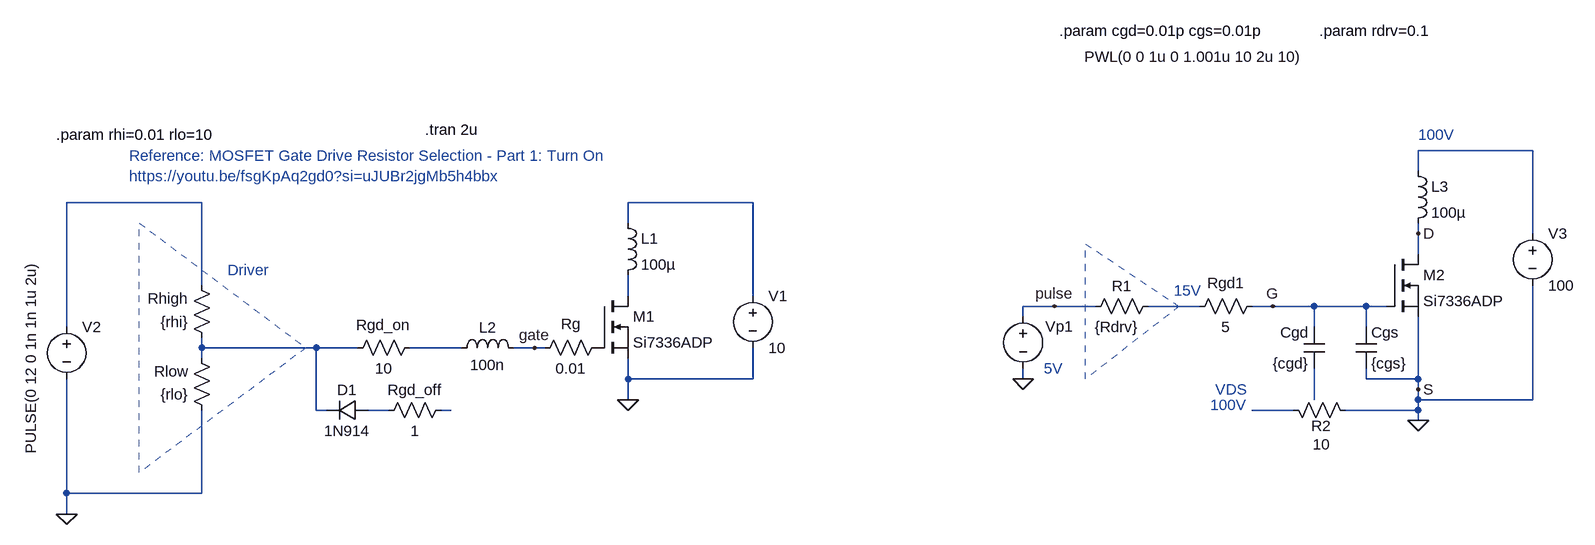
[diagram p0: schematic 04-gate_driver_model.asc]
04-gate_driver_model.asc, the LTspice schematic file:
Version 4
SHEET 1 2392 680
WIRE 2224 96 2048 96
WIRE 2048 128 2048 96
WIRE 176 176 -32 176
WIRE 1024 176 832 176
WIRE 832 208 832 176
WIRE 2048 224 2048 208
WIRE 2224 224 2224 96
WIRE 2048 256 2048 224
WIRE 176 304 176 176
WIRE 832 320 832 288
WIRE 1024 320 1024 176
WIRE 1488 336 1440 336
WIRE 1552 336 1488 336
WIRE 1712 336 1632 336
WIRE 1824 336 1792 336
WIRE 1888 336 1824 336
WIRE 1968 336 1888 336
WIRE 2000 336 1968 336
WIRE 1440 352 1440 336
WIRE -32 368 -32 176
WIRE 1888 368 1888 336
WIRE 1968 368 1968 336
WIRE 176 400 176 384
WIRE 352 400 176 400
WIRE 416 400 352 400
WIRE 576 400 496 400
WIRE 688 400 656 400
WIRE 704 400 688 400
WIRE 176 416 176 400
WIRE 832 448 832 416
WIRE 1024 448 1024 400
WIRE 1024 448 832 448
WIRE 1440 448 1440 432
WIRE 1968 448 1968 432
WIRE 2048 448 2048 352
WIRE 2048 448 1968 448
WIRE 2048 464 2048 448
WIRE 832 480 832 448
WIRE 1888 480 1888 432
WIRE 2048 480 2048 464
WIRE 2224 480 2224 304
WIRE 2224 480 2048 480
WIRE 352 496 352 400
WIRE 368 496 352 496
WIRE 464 496 432 496
WIRE 560 496 544 496
WIRE 1856 496 1792 496
WIRE 2048 496 2048 480
WIRE 2048 496 1936 496
WIRE 2048 512 2048 496
WIRE -32 624 -32 448
WIRE 176 624 176 496
WIRE 176 624 -32 624
WIRE -32 656 -32 624
FLAG 832 480 0
FLAG -32 656 0
FLAG 2048 512 0
FLAG 1440 448 0
FLAG 1824 336 G
FLAG 2048 224 D
FLAG 1488 336 pulse
FLAG 2048 464 S
FLAG 688 400 gate
SYMBOL nmos 784 320 R0
SYMATTR InstName M1
SYMATTR Value Si7336ADP
SYMBOL res 800 384 R90
WINDOW 0 -5 56 VBottom 2
WINDOW 3 32 56 VTop 2
SYMATTR InstName Rg
SYMATTR Value 0.01
SYMBOL res 512 384 R90
WINDOW 0 -4 56 VBottom 2
WINDOW 3 32 56 VTop 2
SYMATTR InstName Rgd_on
SYMATTR Value 10
SYMBOL res 192 400 R180
WINDOW 0 36 76 Left 2
WINDOW 3 36 40 Left 2
SYMATTR InstName Rhigh
SYMATTR Value {rhi}
SYMBOL res 192 512 R180
WINDOW 0 36 76 Left 2
WINDOW 3 36 40 Left 2
SYMATTR InstName Rlow
SYMATTR Value {rlo}
SYMBOL voltage 1024 304 R0
WINDOW 123 0 0 Left 0
WINDOW 39 0 0 Left 0
SYMATTR InstName V1
SYMATTR Value 10
SYMBOL ind 816 192 R0
SYMATTR InstName L1
SYMATTR Value 100µ
SYMATTR SpiceLine Rser=0.1
SYMBOL ind 560 416 R270
WINDOW 0 32 56 VTop 2
WINDOW 3 5 56 VBottom 2
SYMATTR InstName L2
SYMATTR Value 100n
SYMBOL voltage -32 352 R0
WINDOW 3 -55 -86 VRight 2
WINDOW 123 0 0 Left 0
WINDOW 39 0 0 Left 0
SYMATTR Value PULSE(0 12 0 1n 1n 1u 2u)
SYMATTR InstName V2
SYMBOL nmos 2000 256 R0
SYMATTR InstName M2
SYMATTR Value Si7336ADP
SYMBOL res 1808 320 R90
WINDOW 0 -4 56 VBottom 2
WINDOW 3 32 56 VTop 2
SYMATTR InstName Rgd1
SYMATTR Value 5
SYMBOL voltage 2224 208 R0
WINDOW 123 0 0 Left 0
WINDOW 39 0 0 Left 0
SYMATTR InstName V3
SYMATTR Value 100
SYMBOL ind 2032 112 R0
SYMATTR InstName L3
SYMATTR Value 100µ
SYMATTR SpiceLine Rser=0.1
SYMBOL res 1648 320 R90
WINDOW 0 0 56 VBottom 2
WINDOW 3 32 64 VTop 2
SYMATTR InstName R1
SYMATTR Value {Rdrv}
SYMBOL voltage 1440 336 R0
WINDOW 0 34 31 Left 2
WINDOW 3 94 -384 Left 2
WINDOW 123 0 0 Left 0
WINDOW 39 0 0 Left 0
SYMATTR InstName Vp1
SYMATTR Value PWL(0 0 1u 0 1.001u 10 2u 10)
SYMBOL cap 1904 432 R180
WINDOW 0 24 56 Left 2
WINDOW 3 24 8 Left 2
SYMATTR InstName Cgd
SYMATTR Value {cgd}
SYMBOL cap 1952 368 R0
SYMATTR InstName Cgs
SYMATTR Value {cgs}
SYMBOL res 1840 480 M90
WINDOW 0 56 59 VBottom 2
WINDOW 3 84 59 VBottom 2
SYMATTR InstName R2
SYMATTR Value 10
SYMBOL res 560 480 R90
WINDOW 0 0 56 VBottom 2
WINDOW 3 32 56 VTop 2
SYMATTR InstName Rgd_off
SYMATTR Value 1
SYMBOL diode 432 480 R90
WINDOW 0 0 32 VBottom 2
WINDOW 3 32 32 VTop 2
SYMATTR InstName D1
SYMATTR Value 1N914
TEXT 64 104 Left 2 ;Reference: MOSFET Gate Drive Resistor Selection - Part 1: Turn On\nhttps://youtu.be/fsgKpAq2gd0?si=uJUBr2jgMb5h4bbx
TEXT 216 280 Left 2 ;Driver
TEXT 520 64 Left 2 !.tran 2u
TEXT -48 72 Left 2 !.param rhi=0.01 rlo=10
TEXT 1896 -88 Left 2 !.param rdrv=0.1
TEXT 1496 -88 Left 2 !.param cgd=0.01p cgs=0.01p
TEXT 2048 72 Left 2 ;100V
TEXT 1472 432 Left 2 ;5V
TEXT 1672 312 Left 2 ;15V
TEXT 1728 488 Left 2 ;100V
TEXT 1736 464 Left 2 ;VDS
LINE Normal 80 208 336 400 2
LINE Normal 336 400 80 592 2
LINE Normal 80 592 80 208 2
LINE Normal 1536 240 1680 336 2
LINE Normal 1680 336 1536 448 2
LINE Normal 1536 448 1536 240 2

The netlist it stands for:
* 04-gate_driver_model.asc
M1 N004 P001 0 0 Si7336ADP
Rg P001 gate 0.01
Rgd_on N007 N006 10
Rhigh N006 N002 {rhi}
Rlow 0 N006 {rlo}
V1 N003 0 10
L1 N003 N004 100µ Rser=0.1
L2 N007 gate 100n
V2 N002 0 PULSE(0 12 0 1n 1n 1u 2u)
M2 D G 0 0 Si7336ADP
Rgd1 G N005 5
V3 N001 0 100
L3 N001 D 100µ Rser=0.1
R1 N005 pulse {Rdrv}
Vp1 pulse 0 PWL(0 0 1u 0 1.001u 10 2u 10)
Cgd N008 G {cgd}
Cgs G 0 {cgs}
R2 N011 0 10
Rgd_off N010 N009 1
D1 N009 N006 1N914
.model D D
.lib standard.dio
.model NMOS NMOS
.model PMOS PMOS
.lib standard.mos
* Reference: MOSFET Gate Drive Resistor Selection - Part 1: Turn On
* https://youtu.be/fsgKpAq2gd0?si=uJUBr2jgMb5h4bbx
* Driver
.tran 2u
.param rhi=0.01 rlo=10
.param rdrv=0.1
.param cgd=0.01p cgs=0.01p
* 100V
* 5V
* 15V
* 100V
* VDS
.backanno
.end

* Results of the author's LTspice run, read from the files saved beside the schematic
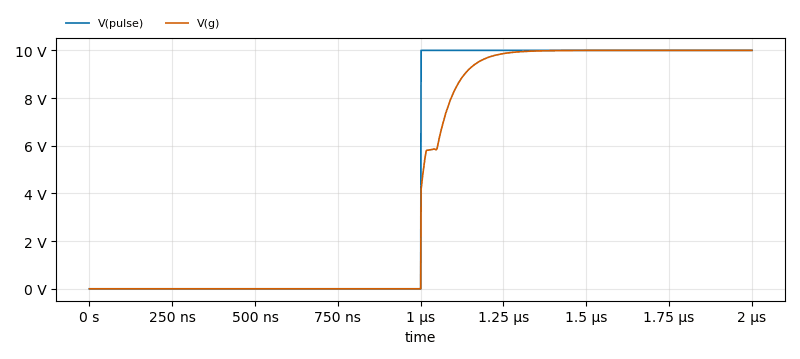
[diagram p1: Transient Analysis of 04-gate_driver_model.asc, plotted from the saved traces]
* Transient Analysis, 1 run:
*   V(pulse): min 0 V, max 10 V, average 4.997 V, rms 7.069 V, last 10 V
*   V(g): min 0 V, max 10 V, average 4.768 V, rms 6.791 V, last 10 V